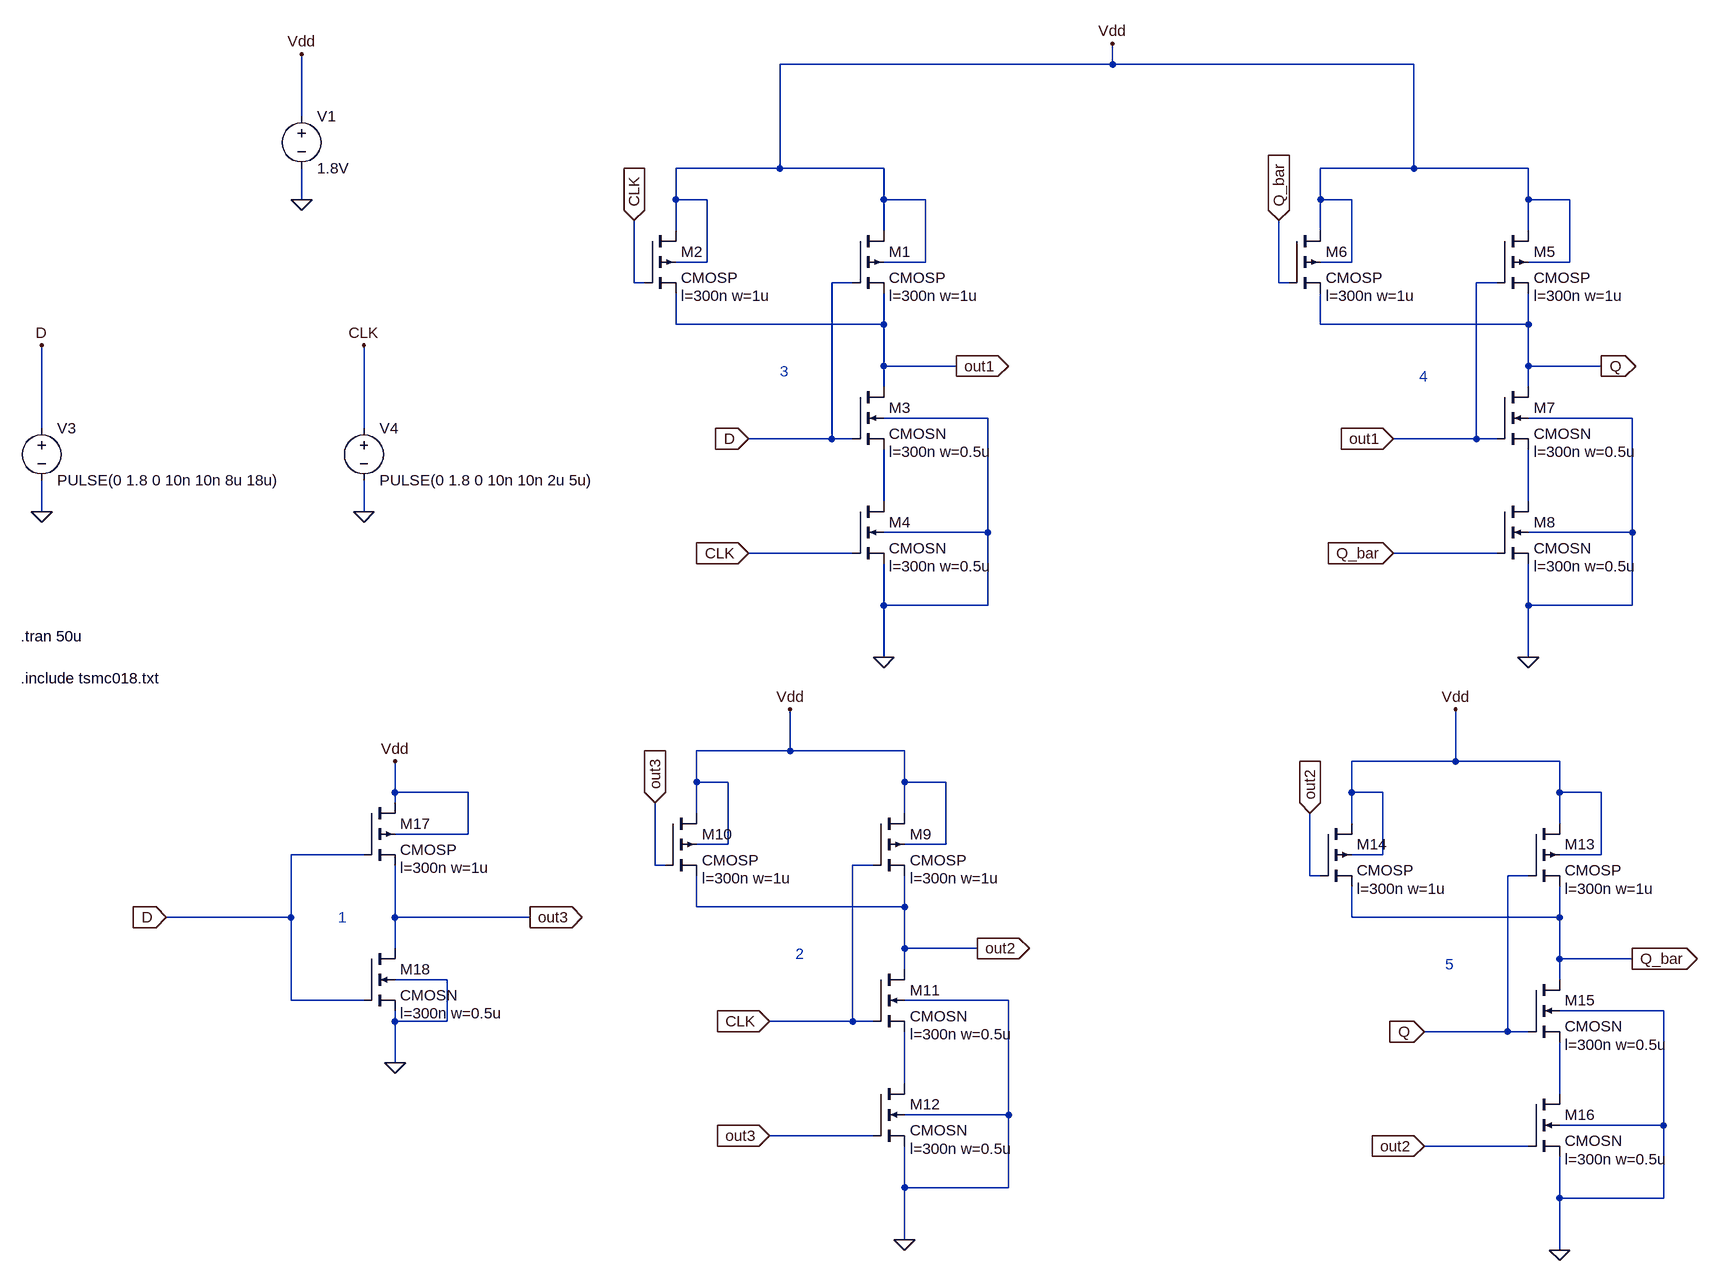
[diagram p0: schematic D_FF.asc]
D_FF.asc, the LTspice schematic file:
Version 4
SHEET 1 1696 1924
WIRE 720 -304 720 -336
WIRE 720 -304 208 -304
WIRE 1184 -304 720 -304
WIRE -528 -224 -528 -320
WIRE 208 -144 208 -304
WIRE 208 -144 48 -144
WIRE 368 -144 208 -144
WIRE 1184 -144 1184 -304
WIRE 1184 -144 1040 -144
WIRE 1360 -144 1184 -144
WIRE -528 -96 -528 -144
WIRE 48 -96 48 -144
WIRE 96 -96 48 -96
WIRE 368 -96 368 -144
WIRE 432 -96 368 -96
WIRE 1040 -96 1040 -144
WIRE 1088 -96 1040 -96
WIRE 1360 -96 1360 -144
WIRE 1424 -96 1360 -96
WIRE 48 -48 48 -96
WIRE 368 -48 368 -96
WIRE 1040 -48 1040 -96
WIRE 1360 -48 1360 -96
WIRE 96 0 96 -96
WIRE 96 0 48 0
WIRE 432 0 432 -96
WIRE 432 0 368 0
WIRE 1088 0 1088 -96
WIRE 1088 0 1040 0
WIRE 1424 0 1424 -96
WIRE 1424 0 1360 0
WIRE -16 32 -16 -64
WIRE 0 32 -16 32
WIRE 320 32 288 32
WIRE 976 32 976 -64
WIRE 992 32 976 32
WIRE 1312 32 1280 32
WIRE 48 96 48 48
WIRE 368 96 368 48
WIRE 368 96 48 96
WIRE 1040 96 1040 48
WIRE 1360 96 1360 48
WIRE 1360 96 1040 96
WIRE 368 160 368 96
WIRE 480 160 368 160
WIRE 1360 160 1360 96
WIRE 1472 160 1360 160
WIRE 368 192 368 160
WIRE 1360 192 1360 160
WIRE 528 240 368 240
WIRE 1520 240 1360 240
WIRE -928 256 -928 128
WIRE -432 256 -432 128
WIRE 288 272 288 32
WIRE 288 272 160 272
WIRE 320 272 288 272
WIRE 1280 272 1280 32
WIRE 1280 272 1152 272
WIRE 1312 272 1280 272
WIRE 368 368 368 288
WIRE 1360 368 1360 288
WIRE -928 384 -928 336
WIRE -432 384 -432 336
WIRE 528 416 528 240
WIRE 528 416 368 416
WIRE 1520 416 1520 240
WIRE 1520 416 1360 416
WIRE 320 448 160 448
WIRE 1312 448 1152 448
WIRE 368 528 368 464
WIRE 528 528 528 416
WIRE 528 528 368 528
WIRE 1360 528 1360 464
WIRE 1520 528 1520 416
WIRE 1520 528 1360 528
WIRE 368 608 368 528
WIRE 1360 608 1360 528
WIRE 224 752 224 688
WIRE 224 752 80 752
WIRE 400 752 224 752
WIRE 1248 768 1248 688
WIRE 1248 768 1088 768
WIRE 1408 768 1248 768
WIRE 80 800 80 752
WIRE 128 800 80 800
WIRE 400 800 400 752
WIRE 464 800 400 800
WIRE -384 816 -384 768
WIRE -272 816 -384 816
WIRE 1088 816 1088 768
WIRE 1136 816 1088 816
WIRE 1408 816 1408 768
WIRE 1472 816 1408 816
WIRE -384 832 -384 816
WIRE 80 848 80 800
WIRE 400 848 400 800
WIRE 1088 864 1088 816
WIRE 1408 864 1408 816
WIRE -272 880 -272 816
WIRE -272 880 -384 880
WIRE 128 896 128 800
WIRE 128 896 80 896
WIRE 464 896 464 800
WIRE 464 896 400 896
WIRE -432 912 -544 912
WIRE 1136 912 1136 816
WIRE 1136 912 1088 912
WIRE 1472 912 1472 816
WIRE 1472 912 1408 912
WIRE 16 928 16 832
WIRE 32 928 16 928
WIRE 352 928 320 928
WIRE 1024 944 1024 848
WIRE 1040 944 1024 944
WIRE 1360 944 1328 944
WIRE 80 992 80 944
WIRE 400 992 400 944
WIRE 400 992 80 992
WIRE -544 1008 -544 912
WIRE -544 1008 -736 1008
WIRE -384 1008 -384 928
WIRE -176 1008 -384 1008
WIRE 1088 1008 1088 960
WIRE 1408 1008 1408 960
WIRE 1408 1008 1088 1008
WIRE -384 1056 -384 1008
WIRE 400 1056 400 992
WIRE 512 1056 400 1056
WIRE 1408 1072 1408 1008
WIRE 1520 1072 1408 1072
WIRE 400 1088 400 1056
WIRE -304 1104 -384 1104
WIRE 1408 1104 1408 1072
WIRE -544 1136 -544 1008
WIRE -432 1136 -544 1136
WIRE 560 1136 400 1136
WIRE 1568 1152 1408 1152
WIRE -384 1168 -384 1152
WIRE -304 1168 -304 1104
WIRE -304 1168 -384 1168
WIRE 320 1168 320 928
WIRE 320 1168 192 1168
WIRE 352 1168 320 1168
WIRE 1328 1184 1328 944
WIRE 1328 1184 1200 1184
WIRE 1360 1184 1328 1184
WIRE -384 1232 -384 1168
WIRE 400 1264 400 1184
WIRE 1408 1280 1408 1200
WIRE 560 1312 560 1136
WIRE 560 1312 400 1312
WIRE 1568 1328 1568 1152
WIRE 1568 1328 1408 1328
WIRE 352 1344 192 1344
WIRE 1360 1360 1200 1360
WIRE 400 1424 400 1360
WIRE 560 1424 560 1312
WIRE 560 1424 400 1424
WIRE 1408 1440 1408 1376
WIRE 1568 1440 1568 1328
WIRE 1568 1440 1408 1440
WIRE 400 1504 400 1424
WIRE 1408 1520 1408 1440
FLAG 160 272 D
IOPIN 160 272 In
FLAG -16 -64 CLK
IOPIN -16 -64 In
FLAG 160 448 CLK
IOPIN 160 448 In
FLAG 480 160 out1
IOPIN 480 160 Out
FLAG 368 608 0
FLAG -528 -96 0
FLAG -928 384 0
FLAG -928 128 D
FLAG 1152 272 out1
IOPIN 1152 272 In
FLAG 976 -64 Q_bar
IOPIN 976 -64 In
FLAG 1152 448 Q_bar
IOPIN 1152 448 In
FLAG 1472 160 Q
IOPIN 1472 160 Out
FLAG 1360 608 0
FLAG 192 1168 CLK
IOPIN 192 1168 In
FLAG 16 832 out3
IOPIN 16 832 In
FLAG 192 1344 out3
IOPIN 192 1344 In
FLAG 512 1056 out2
IOPIN 512 1056 Out
FLAG 400 1504 0
FLAG 1200 1184 Q
IOPIN 1200 1184 In
FLAG 1024 848 out2
IOPIN 1024 848 In
FLAG 1200 1360 out2
IOPIN 1200 1360 In
FLAG 1520 1072 Q_bar
IOPIN 1520 1072 Out
FLAG 1408 1520 0
FLAG 224 688 Vdd
FLAG 1248 688 Vdd
FLAG 720 -336 Vdd
FLAG -528 -320 Vdd
FLAG -432 384 0
FLAG -432 128 CLK
FLAG -384 1232 0
FLAG -384 768 Vdd
FLAG -736 1008 D
IOPIN -736 1008 In
FLAG -176 1008 out3
IOPIN -176 1008 Out
SYMBOL pmos4 320 -48 R0
WINDOW 123 56 100 Left 2
SYMATTR Value2 l=300n w=1u
SYMATTR InstName M1
SYMATTR Value CMOSP
SYMBOL pmos4 0 -48 R0
WINDOW 123 56 100 Left 2
SYMATTR Value2 l=300n w=1u
SYMATTR InstName M2
SYMATTR Value CMOSP
SYMBOL nmos4 320 192 R0
WINDOW 123 56 100 Left 2
SYMATTR Value2 l=300n w=0.5u
SYMATTR InstName M3
SYMATTR Value CMOSN
SYMBOL nmos4 320 368 R0
WINDOW 123 56 100 Left 2
SYMATTR Value2 l=300n w=0.5u
SYMATTR InstName M4
SYMATTR Value CMOSN
SYMBOL voltage -528 -240 R0
WINDOW 123 0 0 Left 0
WINDOW 39 0 0 Left 0
SYMATTR InstName V1
SYMATTR Value 1.8V
SYMBOL voltage -928 240 R0
WINDOW 123 0 0 Left 0
WINDOW 39 0 0 Left 0
SYMATTR InstName V3
SYMATTR Value PULSE(0 1.8 0 10n 10n 8u 18u)
SYMBOL pmos4 1312 -48 R0
WINDOW 123 56 100 Left 2
SYMATTR Value2 l=300n w=1u
SYMATTR InstName M5
SYMATTR Value CMOSP
SYMBOL pmos4 992 -48 R0
WINDOW 123 56 100 Left 2
SYMATTR Value2 l=300n w=1u
SYMATTR InstName M6
SYMATTR Value CMOSP
SYMBOL nmos4 1312 192 R0
WINDOW 123 56 100 Left 2
SYMATTR Value2 l=300n w=0.5u
SYMATTR InstName M7
SYMATTR Value CMOSN
SYMBOL nmos4 1312 368 R0
WINDOW 123 56 100 Left 2
SYMATTR Value2 l=300n w=0.5u
SYMATTR InstName M8
SYMATTR Value CMOSN
SYMBOL pmos4 352 848 R0
WINDOW 123 56 100 Left 2
SYMATTR Value2 l=300n w=1u
SYMATTR InstName M9
SYMATTR Value CMOSP
SYMBOL pmos4 32 848 R0
WINDOW 123 56 100 Left 2
SYMATTR Value2 l=300n w=1u
SYMATTR InstName M10
SYMATTR Value CMOSP
SYMBOL nmos4 352 1088 R0
WINDOW 123 56 100 Left 2
SYMATTR Value2 l=300n w=0.5u
SYMATTR InstName M11
SYMATTR Value CMOSN
SYMBOL nmos4 352 1264 R0
WINDOW 123 56 100 Left 2
SYMATTR Value2 l=300n w=0.5u
SYMATTR InstName M12
SYMATTR Value CMOSN
SYMBOL pmos4 1360 864 R0
WINDOW 123 56 100 Left 2
SYMATTR Value2 l=300n w=1u
SYMATTR InstName M13
SYMATTR Value CMOSP
SYMBOL pmos4 1040 864 R0
WINDOW 123 56 100 Left 2
SYMATTR Value2 l=300n w=1u
SYMATTR InstName M14
SYMATTR Value CMOSP
SYMBOL nmos4 1360 1104 R0
WINDOW 123 56 100 Left 2
SYMATTR Value2 l=300n w=0.5u
SYMATTR InstName M15
SYMATTR Value CMOSN
SYMBOL nmos4 1360 1280 R0
WINDOW 123 56 100 Left 2
SYMATTR Value2 l=300n w=0.5u
SYMATTR InstName M16
SYMATTR Value CMOSN
SYMBOL voltage -432 240 R0
WINDOW 123 0 0 Left 0
WINDOW 39 0 0 Left 0
SYMATTR InstName V4
SYMATTR Value PULSE(0 1.8 0 10n 10n 2u 5u)
SYMBOL pmos4 -432 832 R0
WINDOW 123 56 100 Left 2
SYMATTR InstName M17
SYMATTR Value CMOSP
SYMATTR Value2 l=300n w=1u
SYMBOL nmos4 -432 1056 R0
WINDOW 123 56 100 Left 2
SYMATTR InstName M18
SYMATTR Value CMOSN
SYMATTR Value2 l=300n w=0.5u
TEXT -960 640 Left 2 !.include tsmc018.txt
TEXT -960 576 Left 2 !.tran 50u
TEXT -472 1008 Left 2 ;1
TEXT 232 1064 Left 2 ;2
TEXT 208 168 Left 2 ;3
TEXT 1192 176 Left 2 ;4
TEXT 1232 1080 Left 2 ;5

The netlist it stands for:
* D_FF.asc
M1 Vdd D out1 Vdd CMOSP l=300n w=1u
M2 Vdd CLK out1 Vdd CMOSP l=300n w=1u
M3 out1 D N001 0 CMOSN l=300n w=0.5u
M4 N001 CLK 0 0 CMOSN l=300n w=0.5u
V1 Vdd 0 1.8V
V3 D 0 PULSE(0 1.8 0 10n 10n 8u 18u)
M5 Vdd out1 Q Vdd CMOSP l=300n w=1u
M6 Vdd Q_bar Q Vdd CMOSP l=300n w=1u
M7 Q out1 N002 0 CMOSN l=300n w=0.5u
M8 N002 Q_bar 0 0 CMOSN l=300n w=0.5u
M9 Vdd CLK out2 Vdd CMOSP l=300n w=1u
M10 Vdd out3 out2 Vdd CMOSP l=300n w=1u
M11 out2 CLK N003 0 CMOSN l=300n w=0.5u
M12 N003 out3 0 0 CMOSN l=300n w=0.5u
M13 Vdd Q Q_bar Vdd CMOSP l=300n w=1u
M14 Vdd out2 Q_bar Vdd CMOSP l=300n w=1u
M15 Q_bar Q N004 0 CMOSN l=300n w=0.5u
M16 N004 out2 0 0 CMOSN l=300n w=0.5u
V4 CLK 0 PULSE(0 1.8 0 10n 10n 2u 5u)
M17 Vdd D out3 Vdd CMOSP l=300n w=1u
M18 out3 D 0 0 CMOSN l=300n w=0.5u
.model NMOS NMOS
.model PMOS PMOS
.lib standard.mos
.include tsmc018.txt
.tran 50u
* 1
* 2
* 3
* 4
* 5
.backanno
.end